# EAGLE schematic v002 (EAGLE 6.4)
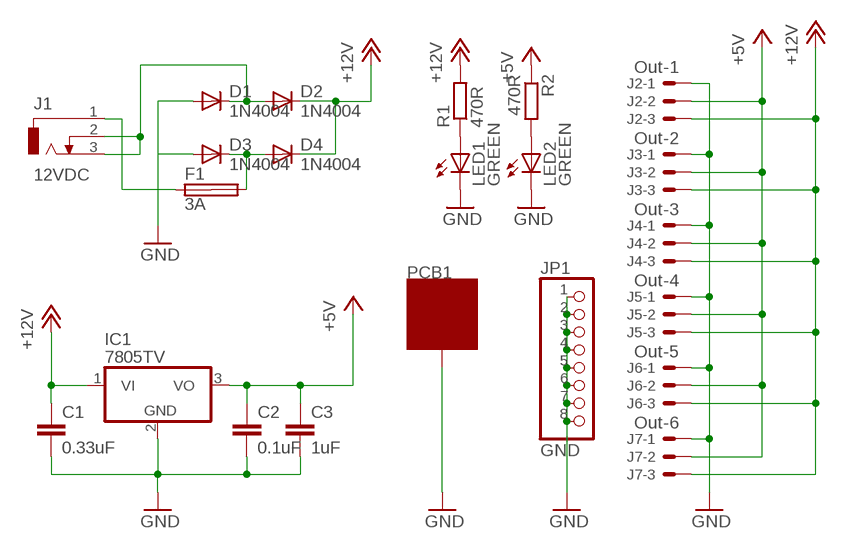
[diagram p0: schematic, sheet 1]

## Parts
C1  0.33uF  C-EU050-030X075  [C050-030X075]
C2  0.1uF  C-EU050-024X044  [C050-024X044]
C3  1uF  C-EU050-045X075  [C050-045X075]
D1  1N4004  1N4148DO35-7  [DO35-7]
D2  1N4004  1N4148DO35-7  [DO35-7]
D3  1N4004  1N4148DO35-7  [DO35-7]
D4  1N4004  1N4148DO35-7  [DO35-7]
F1  3A  SHK20L  [SHK20L]
IC1  7805TV  [TO220V]
J1  12VDC  DCJ0202  [DCJ0202]
J2  Out-1  22-27-2031-03  [6410-03]
J3  Out-2  22-27-2031-03  [6410-03]
J4  Out-3  22-27-2031-03  [6410-03]
J5  Out-4  22-27-2031-03  [6410-03]
J6  Out-5  22-27-2031-03  [6410-03]
J7  Out-6  22-27-2031-03  [6410-03]
JP1  GND  PINHD-1X8  [1X08]
LED1  GREEN  LED3MM  [LED3MM]
LED2  GREEN  LED3MM  [LED3MM]
PCB1  ZZZ_MODULE05X05  [ZZZ_MODULE_05X05]
R1  470R  R-EU_0204/7  [0204/7]
R2  470R  R-EU_0204/7  [0204/7]

## Nets
+5V: C2.1 C3.1 IC1.3(VO) J2.2 J3.2 J4.2 J5.2 J6.2 J7.2 R2.1
+12V: C1.1 D2.C D4.C IC1.1(VI) J2.3 J3.3 J4.3 J5.3 J6.3 J7.3 R1.2
GND: C1.2 C2.2 C3.2 D1.A D3.A IC1.2(GND) J2.1 J3.1 J4.1 J5.1 J6.1 J7.1 JP1.1 JP1.2 JP1.3 JP1.4 JP1.5 JP1.6 JP1.7 JP1.8 LED1.K(C) LED2.K(C) PCB1.GND@1(GND) PCB1.GND@2(GND) PCB1.GND@3(GND) PCB1.GND@4(GND) PCB1.GND@5(GND) PCB1.GND@6(GND) PCB1.GND@7(GND) PCB1.GND@8(GND)
N$1: LED1.A R1.1
N$3: LED2.A R2.2
N$4: F1.1A J1.1
N$7: D1.C D2.A J1.2 J1.3
N$8: D3.C D4.A F1.2A
Unconnected: F1.1B F1.2B

## Library data of the parts
C1-C3 = rcl:C-EU: CAPACITOR, European symbol
D1-D4 = diode:1N4148: DIODE high speed (Philips)
F1 = fuse:SHK20L: FUSE HOLDER 5 x 20 mm, SH contact, SHH1 Schukat, E1073 Buerklin; OC_FARNELL: unknown; OC_NEWARK: unknown
IC1 = linear:78*: Positive VOLTAGE REGULATOR Source: http://cache.national.com/ds/LM/LM78L05.pdf http://www.fairchildsemi.com/ds/LM/LM7805.pdf
J1 = con-jack:DCJ0202: DC POWER JACK Source: DCJ0202.pdf; OC_FARNELL: unknown; OC_NEWARK: unknown
J2-J7 = con-molex:22-?-03: CONNECTOR wire to board 2.54 mm (.1 inch) pitch header; OC_FARNELL: unknown; OC_NEWARK: unknown
JP1 = pinhead:PINHD-1X8: PIN HEADER
LED1 LED2 = led:LED: LED OSRAM: - CHIPLED LG R971, LG N971, LY N971, LG Q971, LY Q971, LO R971, LY R971 LH N974, LH R974 LS Q976, LO Q976, LY Q976 LO Q996 - Hyper CHIPLED LW Q18S LB Q993, LB Q99A, LB R99A - SideLED LS A670, LO A670, LY A670, LG A670, LP A670 LB A673, LV A673, LT A673, LW A673 LH A674 LY A675 LS A676, LA A676, LO A676, LY A676, LW A676 LS A679, LY A679, LG A679 - Hyper Micro SIDELED® LS Y876, LA Y876, LO Y876, LY Y876 LT Y87S - SmartLED LW L88C, LW L88S LB L89C, LB L89S, LG L890 LS L89K, LO L89K, LY L89K LS L896, LA L896, LO L896, LY L896 - TOPLED LS T670, LO T670, LY T670, LG T670, LP T670 LSG T670, LSP T670, LSY T670, LOP T670, LYG T670 LG T671, LOG T671, LSG T671 LB T673, LV T673, LT T673, LW T673 LH T674 LS T676, LA T676, LO T676, LY T676, LB T676, LH T676, LSB T676, LW T676 LB T67C, LV T67C, LT T67C, LS T67K, LO T67K, LY T67K, LW E67C LS E67B, LA E67B, LO E67B, LY E67B, LB E67C, LV E67C, LT E67C LW T67C LS T679, LY T679, LG T679 LS T770, LO T770, LY T770, LG T770, LP T770 LB T773, LV T773, LT T773, LW T773 LH T774 LS E675, LA E675, LY E675, LS T675 LS T776, LA T776, LO T776, LY T776, LB T776 LHGB T686 LT T68C, LB T68C - Hyper Mini TOPLED® LB M676 - Mini TOPLED Santana® LG M470 LS M47K, LO M47K, LY M47K Source: http://www.osram.convergy.de LUXEON: - LUMILED® LXK2-PW12-R00, LXK2-PW12-S00, LXK2-PW14-U00, LXK2-PW14-V00 LXK2-PM12-R00, LXK2-PM12-S00, LXK2-PM14-U00 LXK2-PE12-Q00, LXK2-PE12-R00, LXK2-PE12-S00, LXK2-PE14-T00, LXK2-PE14-U00 LXK2-PB12-K00, LXK2-PB12-L00, LXK2-PB12-M00, LXK2-PB14-N00, LXK2-PB14-P00, LXK2-PB14-Q00 LXK2-PR12-L00, LXK2-PR12-M00, LXK2-PR14-Q00, LXK2-PR14-R00 LXK2-PD12-Q00, LXK2-PD12-R00, LXK2-PD12-S00 LXK2-PH12-R00, LXK2-PH12-S00 LXK2-PL12-P00, LXK2-PL12-Q00, LXK2-PL12-R00 Source: www.luxeon.com KINGBRIGHT: KA-3528ASYC Source: www.kingbright.com
PCB1 = GNLib:ZZZ_MODULE
R1 R2 = rcl:R-EU_: RESISTOR, European symbol